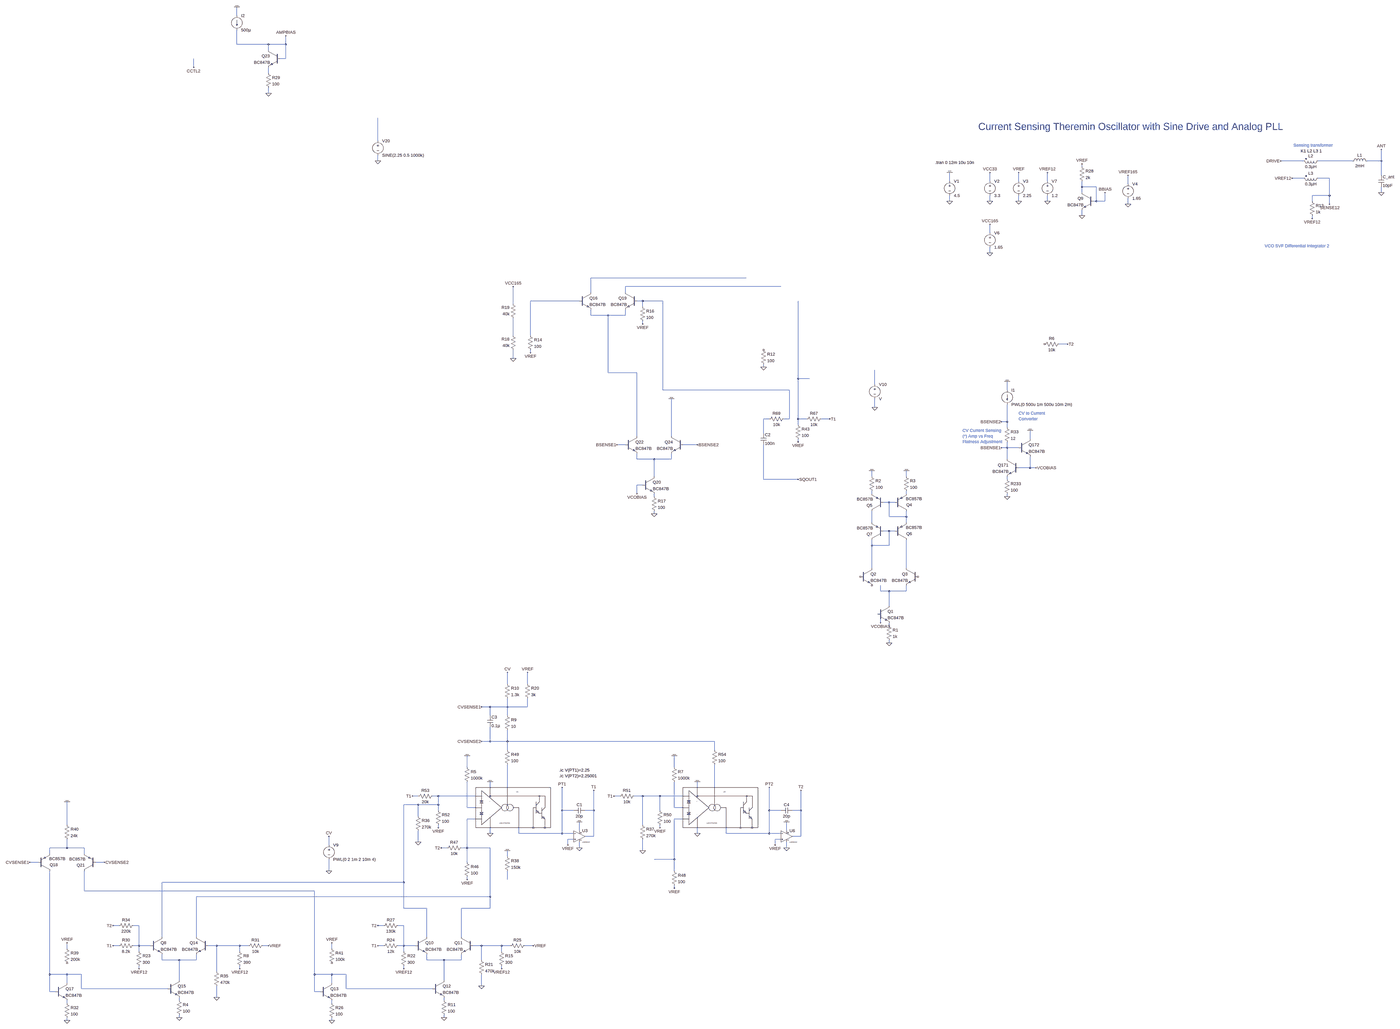
[diagram p0: schematic theremin_oscillator_ota_v01.asc, whole sheet]
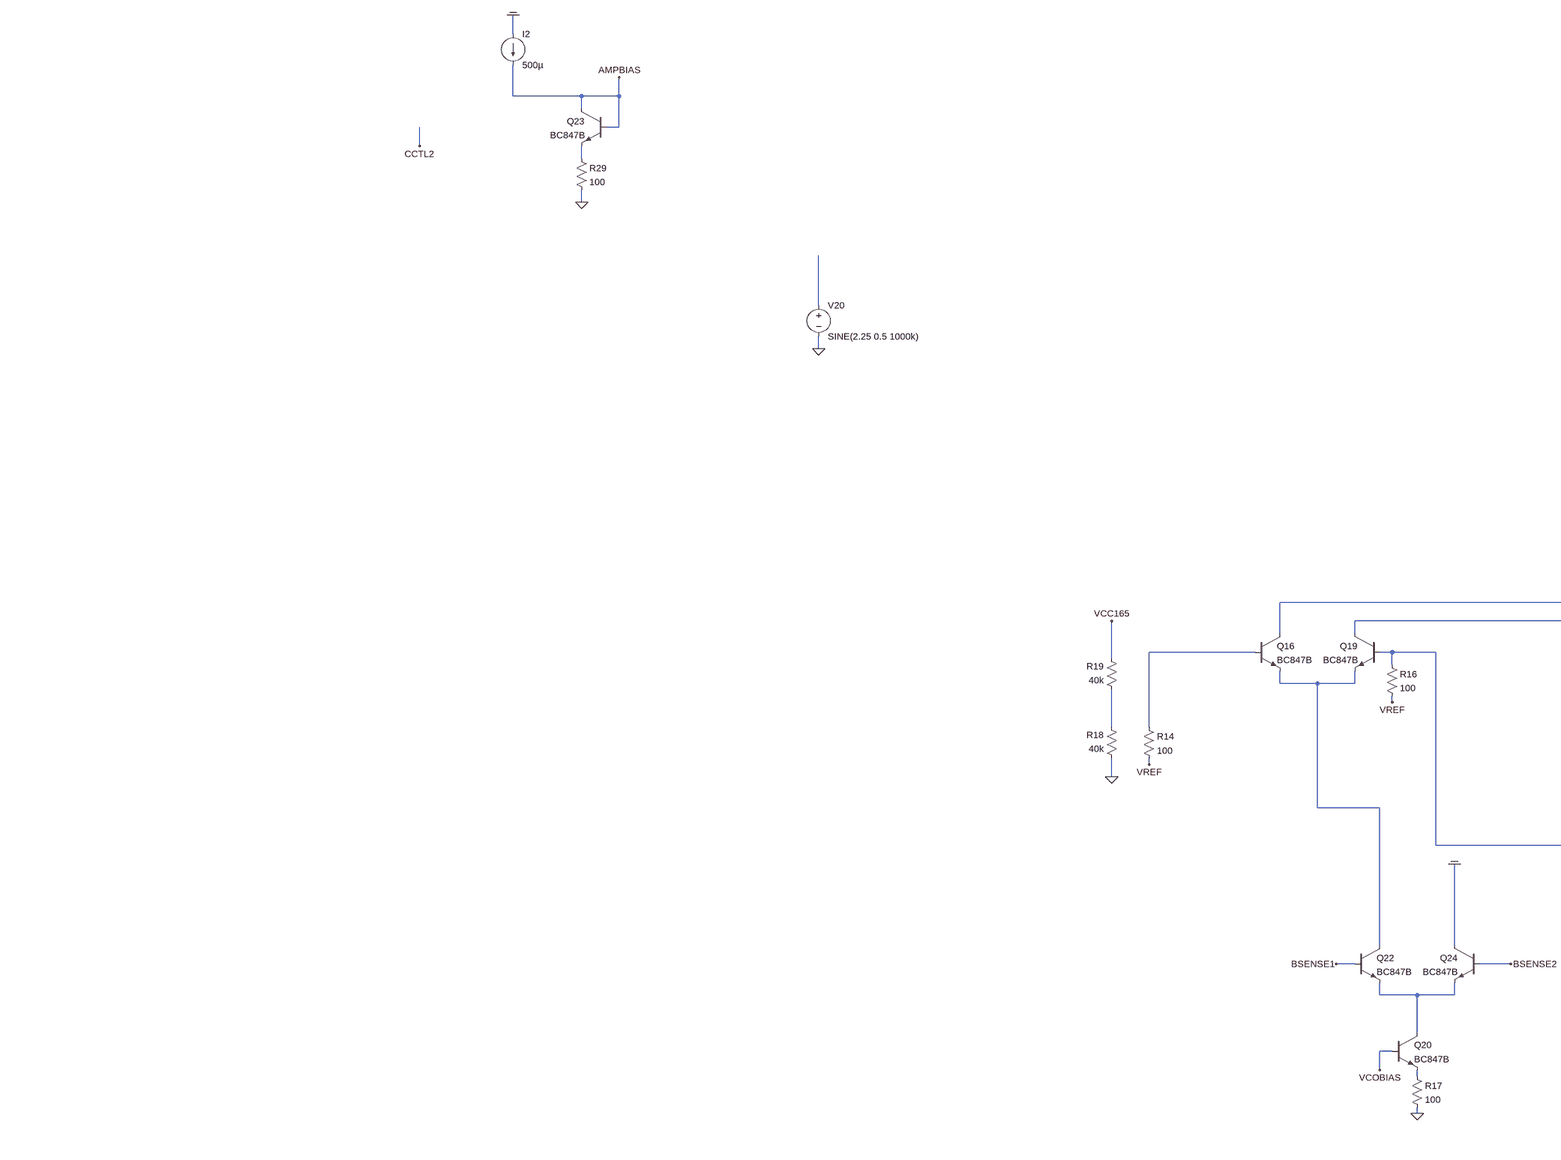
[diagram p1: schematic theremin_oscillator_ota_v01.asc, part, row 1 of 2, column 1 of 2]
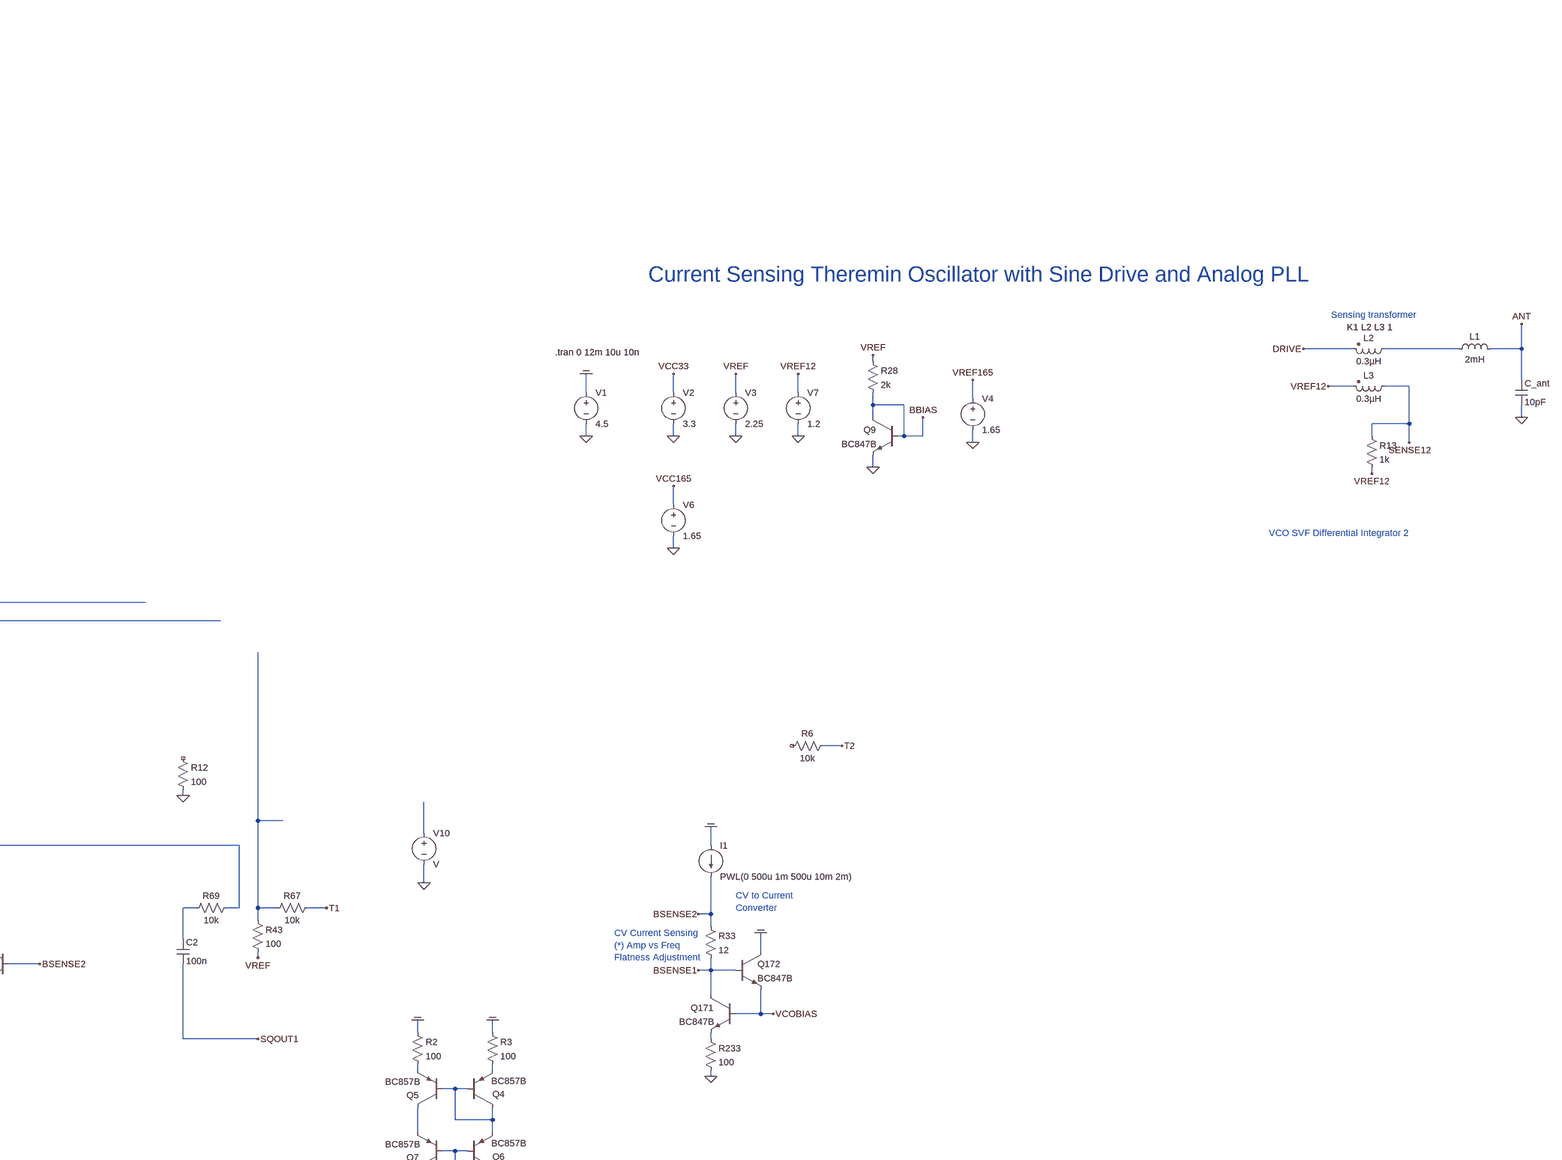
[diagram p2: schematic theremin_oscillator_ota_v01.asc, part, row 1 of 2, column 2 of 2]
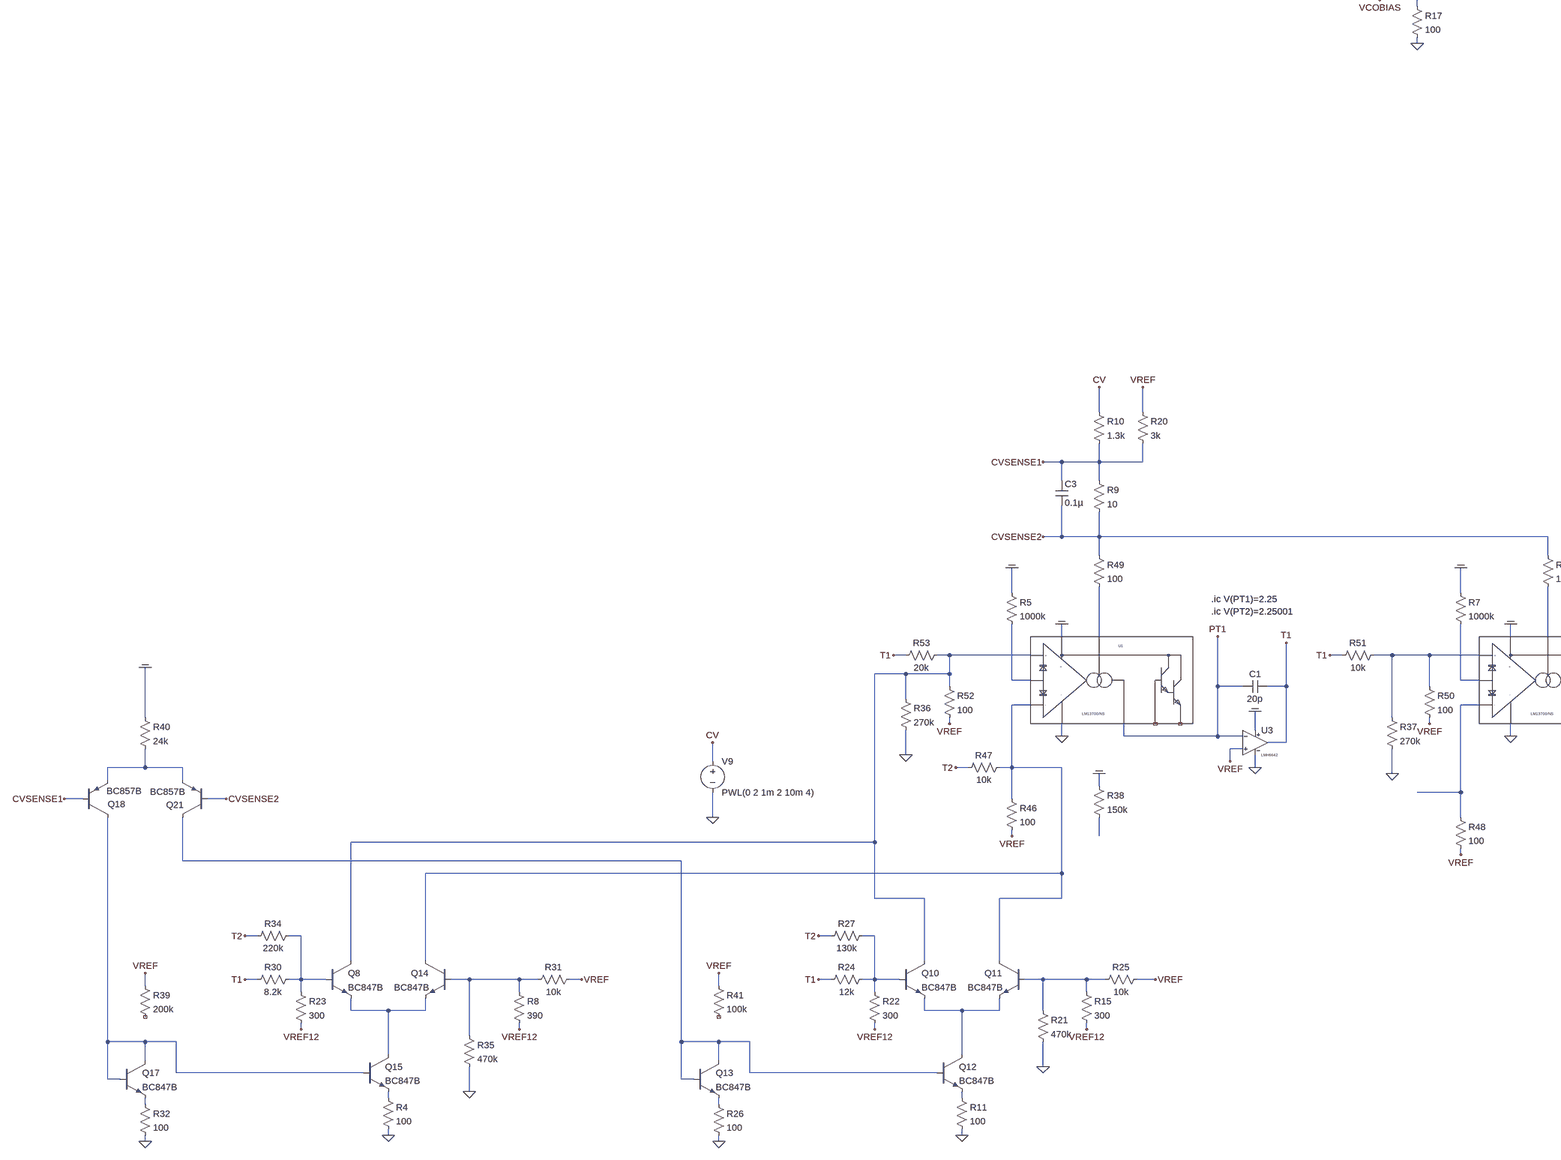
[diagram p3: schematic theremin_oscillator_ota_v01.asc, part, row 2 of 2, column 1 of 2]
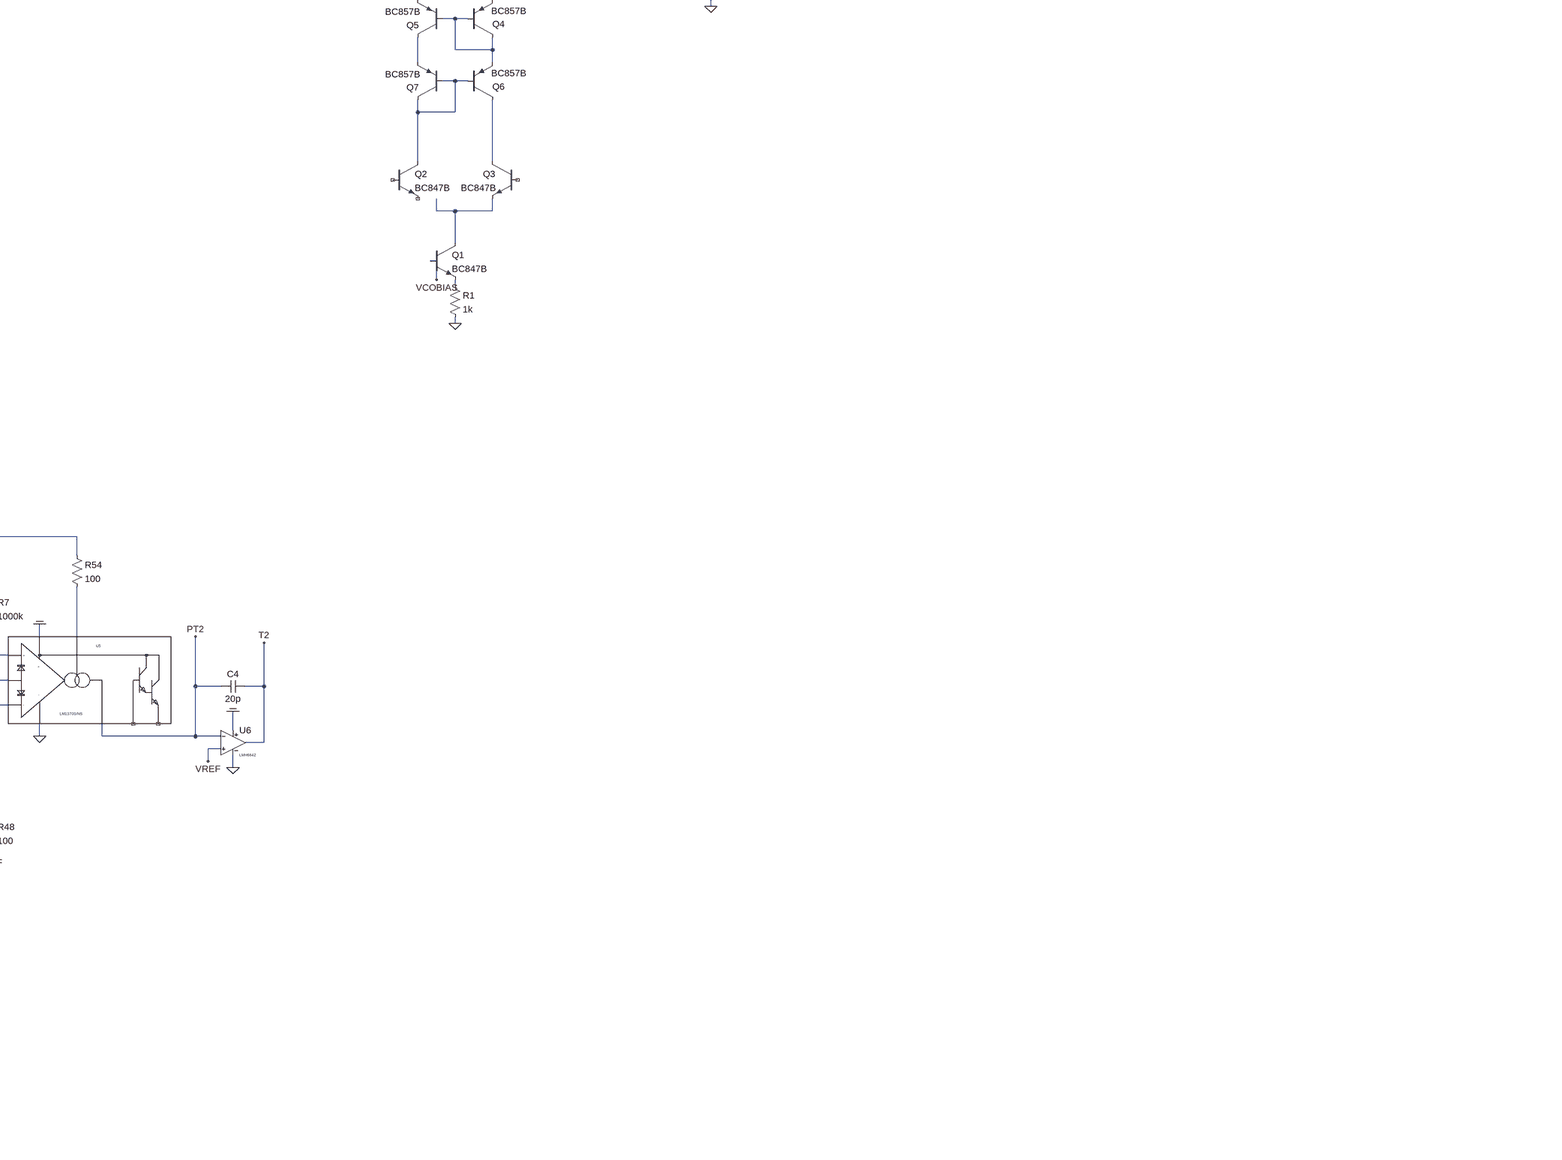
[diagram p4: schematic theremin_oscillator_ota_v01.asc, part, row 2 of 2, column 2 of 2]
theremin_oscillator_ota_v01.asc, the LTspice schematic file:
Version 4
SHEET 1 17540 12720
WIRE -192 2960 -192 2912
WIRE -192 3120 -192 3040
WIRE -16 3120 -192 3120
WIRE 80 3120 80 3072
WIRE 80 3120 -16 3120
WIRE -16 3152 -16 3120
WIRE 80 3200 80 3120
WIRE 80 3200 48 3200
WIRE -432 3248 -432 3200
WIRE -16 3280 -16 3248
WIRE -16 3392 -16 3360
WIRE 592 3664 592 3536
WIRE 592 3776 592 3744
WIRE 5840 3776 5712 3776
WIRE 6112 3776 5920 3776
WIRE 6272 3776 6272 3712
WIRE 6272 3776 6192 3776
WIRE 4608 3808 4608 3792
WIRE 6272 3856 6272 3776
WIRE 5840 3872 5776 3872
WIRE 5984 3872 5920 3872
WIRE 3872 3888 3872 3840
WIRE 4096 3888 4096 3840
WIRE 4256 3888 4256 3840
WIRE 4416 3888 4416 3840
WIRE 4864 3904 4864 3856
WIRE 4608 3920 4608 3888
WIRE 4688 3920 4608 3920
WIRE 4608 3952 4608 3920
WIRE 6272 3952 6272 3920
WIRE 5984 3968 5984 3872
WIRE 5984 3968 5888 3968
WIRE 3872 4000 3872 3968
WIRE 4096 4000 4096 3968
WIRE 4256 4000 4256 3968
WIRE 4416 4000 4416 3968
WIRE 4688 4000 4688 3920
WIRE 4688 4000 4672 4000
WIRE 4736 4000 4736 3952
WIRE 4736 4000 4688 4000
WIRE 5888 4000 5888 3968
WIRE 4864 4016 4864 3984
WIRE 5984 4016 5984 3968
WIRE 4608 4080 4608 4048
WIRE 5888 4096 5888 4080
WIRE 4096 4176 4096 4128
WIRE 4096 4288 4096 4256
WIRE 2640 5152 1776 5152
WIRE 2832 5200 1968 5200
WIRE 1776 5232 1776 5152
WIRE 1968 5232 1968 5200
WIRE 1712 5280 1440 5280
WIRE 2064 5280 2032 5280
WIRE 2176 5280 2064 5280
WIRE 1344 5296 1344 5200
WIRE 2064 5312 2064 5280
WIRE 1776 5360 1776 5328
WIRE 1872 5360 1776 5360
WIRE 1968 5360 1968 5328
WIRE 1968 5360 1872 5360
WIRE 2064 5408 2064 5392
WIRE 1344 5472 1344 5376
WIRE 1440 5472 1440 5280
WIRE 4528 5520 4480 5520
WIRE 1440 5568 1440 5552
WIRE 1344 5600 1344 5552
WIRE 2736 5648 2736 5632
WIRE 1872 5680 1872 5360
WIRE 2032 5680 1872 5680
WIRE 2928 5712 2928 5280
WIRE 2992 5712 2928 5712
WIRE 3456 5744 3456 5664
WIRE 2176 5776 2176 5280
WIRE 2880 5776 2176 5776
WIRE 4192 5776 4192 5728
WIRE 3456 5872 3456 5824
WIRE 2768 5936 2736 5936
WIRE 2880 5936 2880 5776
WIRE 2880 5936 2848 5936
WIRE 2928 5936 2928 5712
WIRE 2976 5936 2928 5936
WIRE 3104 5936 3056 5936
WIRE 4192 5952 4192 5856
WIRE 4192 5952 4160 5952
WIRE 2928 5968 2928 5936
WIRE 4192 5984 4192 5952
WIRE 2736 6016 2736 5936
WIRE 2032 6032 2032 5680
WIRE 2224 6032 2224 5824
WIRE 4320 6048 4320 6000
WIRE 2928 6064 2928 6048
WIRE 1968 6080 1920 6080
WIRE 2368 6080 2288 6080
WIRE 4192 6096 4192 6064
WIRE 4192 6096 4160 6096
WIRE 4256 6096 4192 6096
WIRE 2032 6160 2032 6128
WIRE 2128 6160 2032 6160
WIRE 2224 6160 2224 6128
WIRE 2224 6160 2128 6160
WIRE 4192 6160 4192 6096
WIRE 4320 6208 4320 6144
WIRE 4320 6208 4256 6208
WIRE 4352 6208 4320 6208
WIRE 2128 6256 2128 6160
WIRE 3440 6256 3440 6224
WIRE 3632 6256 3632 6224
WIRE 2736 6272 2736 6080
WIRE 2928 6272 2736 6272
WIRE 4192 6272 4192 6256
WIRE 2064 6304 2032 6304
WIRE 2032 6352 2032 6304
WIRE 3440 6352 3440 6336
WIRE 3632 6352 3632 6336
WIRE 2128 6368 2128 6352
WIRE 4192 6368 4192 6352
WIRE 3536 6400 3504 6400
WIRE 3568 6400 3536 6400
WIRE 2128 6464 2128 6448
WIRE 3536 6480 3536 6400
WIRE 3632 6480 3632 6448
WIRE 3632 6480 3536 6480
WIRE 3440 6512 3440 6448
WIRE 3632 6512 3632 6480
WIRE 3536 6560 3504 6560
WIRE 3568 6560 3536 6560
WIRE 3440 6640 3440 6608
WIRE 3536 6640 3536 6560
WIRE 3536 6640 3440 6640
WIRE 3440 6816 3440 6640
WIRE 3632 6816 3632 6608
WIRE 3488 6944 3488 6912
WIRE 3536 6944 3488 6944
WIRE 3632 6944 3632 6912
WIRE 3632 6944 3536 6944
WIRE 3536 7024 3536 6944
WIRE 3488 7072 3472 7072
WIRE 3488 7120 3488 7072
WIRE 3536 7136 3536 7120
WIRE 3536 7232 3536 7216
WIRE 1312 8464 1312 8400
WIRE 1424 8464 1424 8400
WIRE 1216 8592 1168 8592
WIRE 1312 8592 1312 8544
WIRE 1312 8592 1216 8592
WIRE 1424 8592 1424 8544
WIRE 1424 8592 1312 8592
WIRE 1216 8640 1216 8592
WIRE 1312 8640 1312 8592
WIRE 1216 8784 1216 8704
WIRE 1216 8784 1168 8784
WIRE 1312 8784 1312 8720
WIRE 1312 8784 1216 8784
WIRE 2464 8784 1312 8784
WIRE 1312 8832 1312 8784
WIRE 2464 8832 2464 8784
WIRE 1088 8928 1088 8864
WIRE 2240 8928 2240 8864
WIRE 1216 9040 1216 9008
WIRE 1312 9040 1312 8912
WIRE 2368 9040 2368 9008
WIRE 2464 9040 2464 8912
WIRE 816 9088 784 9088
WIRE 928 9088 896 9088
WIRE 1136 9088 928 9088
WIRE 1936 9088 1904 9088
WIRE 2064 9088 2016 9088
WIRE 2160 9088 2064 9088
WIRE 2288 9088 2160 9088
WIRE 816 9136 736 9136
WIRE 928 9136 928 9088
WIRE 928 9136 816 9136
WIRE 1088 9152 1088 9008
WIRE 1136 9152 1088 9152
WIRE 2240 9152 2240 9008
WIRE 2288 9152 2240 9152
WIRE 928 9168 928 9136
WIRE 1616 9168 1616 9040
WIRE 1680 9168 1616 9168
WIRE 1792 9168 1792 9056
WIRE 1792 9168 1744 9168
WIRE 2160 9168 2160 9088
WIRE 2768 9168 2768 9040
WIRE 2832 9168 2768 9168
WIRE 2944 9168 2944 9056
WIRE 2944 9168 2896 9168
WIRE 816 9200 816 9136
WIRE 1136 9216 1088 9216
WIRE 2288 9216 2240 9216
WIRE -1136 9248 -1136 9120
WIRE 2064 9248 2064 9088
WIRE 928 9264 928 9248
WIRE 2160 9264 2160 9248
WIRE 1712 9280 1712 9232
WIRE 2864 9280 2864 9232
WIRE 1216 9296 1216 9264
WIRE 1376 9296 1376 9264
WIRE 1616 9296 1616 9168
WIRE 1616 9296 1376 9296
WIRE 1680 9296 1616 9296
WIRE 2368 9296 2368 9264
WIRE 2528 9296 2528 9264
WIRE 2768 9296 2768 9168
WIRE 2768 9296 2528 9296
WIRE 2832 9296 2768 9296
WIRE 1792 9312 1792 9168
WIRE 1792 9312 1744 9312
WIRE 2944 9312 2944 9168
WIRE 2944 9312 2896 9312
WIRE 1680 9328 1648 9328
WIRE 2832 9328 2800 9328
WIRE 816 9344 816 9280
WIRE 320 9360 320 9312
WIRE 1648 9360 1648 9328
WIRE 2800 9360 2800 9328
WIRE -1136 9376 -1136 9328
WIRE -1136 9376 -1232 9376
WIRE -1040 9376 -1136 9376
WIRE 976 9376 944 9376
WIRE 1088 9376 1088 9216
WIRE 1088 9376 1056 9376
WIRE 1216 9376 1088 9376
WIRE 1712 9376 1712 9344
WIRE 2864 9376 2864 9344
WIRE 2064 9392 2064 9328
WIRE -1232 9408 -1232 9376
WIRE -1040 9408 -1040 9376
WIRE 1312 9424 1312 9392
WIRE 2240 9440 2240 9216
WIRE 2240 9440 2128 9440
WIRE -1296 9456 -1344 9456
WIRE -928 9456 -976 9456
WIRE 1088 9456 1088 9376
WIRE 320 9504 320 9440
WIRE 2240 9504 2240 9440
WIRE 1088 9552 1088 9536
WIRE 1312 9552 1312 9504
WIRE 736 9568 736 9136
WIRE 736 9568 -608 9568
WIRE 2240 9600 2240 9584
WIRE -1040 9616 -1040 9504
WIRE 240 9616 -1040 9616
WIRE 1216 9648 1216 9376
WIRE 1216 9648 -416 9648
WIRE 736 9712 736 9568
WIRE 864 9712 736 9712
WIRE 1216 9712 1216 9648
WIRE 1216 9712 1056 9712
WIRE -848 9808 -880 9808
WIRE -736 9808 -768 9808
WIRE 624 9808 592 9808
WIRE 736 9808 704 9808
WIRE -608 9872 -608 9568
WIRE -416 9872 -416 9648
WIRE 864 9872 864 9712
WIRE 1056 9872 1056 9712
WIRE -848 9920 -880 9920
WIRE -736 9920 -736 9808
WIRE -736 9920 -768 9920
WIRE -672 9920 -736 9920
WIRE -304 9920 -352 9920
WIRE -176 9920 -304 9920
WIRE -128 9920 -176 9920
WIRE -16 9920 -48 9920
WIRE 624 9920 592 9920
WIRE 736 9920 736 9808
WIRE 736 9920 704 9920
WIRE 800 9920 736 9920
WIRE 1168 9920 1120 9920
WIRE 1280 9920 1168 9920
WIRE 1328 9920 1280 9920
WIRE 1456 9920 1408 9920
WIRE -1136 9936 -1136 9904
WIRE 336 9936 336 9904
WIRE -736 9952 -736 9920
WIRE -176 9952 -176 9920
WIRE 736 9952 736 9920
WIRE 1280 9952 1280 9920
WIRE -608 10000 -608 9968
WIRE -512 10000 -608 10000
WIRE -416 10000 -416 9968
WIRE -416 10000 -512 10000
WIRE 864 10000 864 9968
WIRE 960 10000 864 10000
WIRE 1056 10000 1056 9968
WIRE 1056 10000 960 10000
WIRE 1168 10000 1168 9920
WIRE -736 10048 -736 10032
WIRE -176 10048 -176 10032
WIRE 736 10048 736 10032
WIRE 1280 10048 1280 10032
WIRE -304 10064 -304 9920
WIRE -1232 10080 -1232 9504
WIRE -1136 10080 -1232 10080
WIRE -1056 10080 -1136 10080
WIRE 240 10080 240 9616
WIRE 336 10080 240 10080
WIRE 416 10080 336 10080
WIRE -512 10112 -512 10000
WIRE 960 10112 960 10000
WIRE -1136 10128 -1136 10080
WIRE 336 10128 336 10080
WIRE 1168 10144 1168 10080
WIRE -1056 10160 -1056 10080
WIRE -576 10160 -1056 10160
WIRE 416 10160 416 10080
WIRE 896 10160 416 10160
WIRE -1232 10176 -1232 10080
WIRE -1200 10176 -1232 10176
WIRE 240 10176 240 10080
WIRE 272 10176 240 10176
WIRE -304 10208 -304 10144
WIRE -512 10224 -512 10208
WIRE 960 10224 960 10208
WIRE -1136 10240 -1136 10224
WIRE 336 10240 336 10224
WIRE -512 10320 -512 10304
WIRE 960 10320 960 10304
WIRE -1136 10336 -1136 10320
WIRE 336 10336 336 10320
FLAG 3872 4000 0
FLAG 3872 3840 COM
FLAG 4096 4000 0
FLAG 4096 3840 VCC33
FLAG 4256 4000 0
FLAG 4256 3840 VREF
FLAG 6272 3712 ANT
FLAG 6272 3952 0
FLAG 5712 3776 DRIVE
FLAG 4416 4000 0
FLAG 4416 3840 VREF12
FLAG 5776 3872 VREF12
FLAG 5984 4016 SENSE12
FLAG 5888 4096 VREF12
FLAG -432 3248 CCTL2
FLAG 592 3776 0
FLAG 4192 6368 0
FLAG 4320 6000 COM
FLAG 4352 6208 VCOBIAS
FLAG -16 3392 0
FLAG -192 2912 COM
FLAG 80 3072 AMPBIAS
FLAG 4160 6096 BSENSE1
FLAG 4160 5952 BSENSE2
FLAG 4608 4080 0
FLAG 4736 3952 BBIAS
FLAG 4608 3792 VREF
FLAG 4864 4016 0
FLAG 4864 3856 VREF165
FLAG 2928 6064 VREF
FLAG 3104 5936 T1
FLAG 4192 5728 COM
FLAG 3536 7232 0
FLAG 3488 7120 VCOBIAS
FLAG 3440 6224 COM
FLAG 3632 6224 COM
FLAG 4096 4288 0
FLAG 4096 4128 VCC165
FLAG 4528 5520 T2
FLAG 2928 6272 SQOUT1
FLAG 1440 5568 VREF
FLAG 2064 5408 VREF
FLAG 2128 6464 0
FLAG 2032 6352 VCOBIAS
FLAG 1920 6080 BSENSE1
FLAG 2368 6080 BSENSE2
FLAG 2736 5648 0
FLAG 2224 5824 COM
FLAG 1344 5200 VCC165
FLAG 1344 5600 0
FLAG 3456 5872 0
FLAG 1216 9296 0
FLAG 1216 9008 COM
FLAG 1712 9376 0
FLAG 1712 9232 COM
FLAG 1648 9360 VREF
FLAG 1792 9056 T1
FLAG 1616 9040 PT1
FLAG 2368 9296 0
FLAG 2368 9008 COM
FLAG 2864 9376 0
FLAG 2864 9232 COM
FLAG 2800 9360 VREF
FLAG 2944 9056 T2
FLAG 2768 9040 PT2
FLAG 1088 9552 VREF
FLAG 944 9376 T2
FLAG 2240 9600 VREF
FLAG 2160 9264 VREF
FLAG 1904 9088 T1
FLAG 928 9264 VREF
FLAG 784 9088 T1
FLAG 1088 8864 COM
FLAG 2240 8864 COM
FLAG 960 10320 0
FLAG 1280 10048 VREF12
FLAG 336 10336 0
FLAG 1456 9920 VREF
FLAG 320 9504 0
FLAG 320 9312 CV
FLAG 1312 8400 CV
FLAG 1424 8400 VREF
FLAG 1168 8592 CVSENSE1
FLAG 1168 8784 CVSENSE2
FLAG 1168 10144 0
FLAG -512 10320 0
FLAG -176 10048 VREF12
FLAG -736 10048 VREF12
FLAG -880 9920 T1
FLAG -1136 10336 0
FLAG -16 9920 VREF
FLAG -880 9808 T2
FLAG -304 10208 0
FLAG -1344 9456 CVSENSE1
FLAG -928 9456 CVSENSE2
FLAG 736 10048 VREF12
FLAG 592 9920 T1
FLAG 592 9808 T2
FLAG 816 9344 0
FLAG 2064 9392 0
FLAG 1312 9392 COM
FLAG -1136 9904 VREF
FLAG 336 9904 VREF
FLAG -1136 9120 COM
SYMBOL voltage 3872 3872 R0
SYMATTR InstName V1
SYMATTR Value 4.5
SYMBOL voltage 4096 3872 R0
SYMATTR InstName V2
SYMATTR Value 3.3
SYMBOL voltage 4256 3872 R0
SYMATTR InstName V3
SYMATTR Value 2.25
SYMBOL ind 6096 3792 R270
WINDOW 0 32 56 VTop 2
WINDOW 3 5 56 VBottom 2
SYMATTR InstName L1
SYMATTR Value 2mH
SYMATTR SpiceLine Rser=120 Cpar=1pF
SYMBOL Cap 6256 3856 R0
SYMATTR InstName C_ant
SYMATTR Value 10pF
SYMBOL voltage 4416 3872 R0
SYMATTR InstName V7
SYMATTR Value 1.2
SYMBOL ind2 5936 3760 R90
WINDOW 0 4 56 VBottom 2
WINDOW 3 32 56 VTop 2
SYMATTR InstName L2
SYMATTR Value 0.3µH
SYMATTR SpiceLine Rser=0.1 Cpar=0.1p
SYMBOL ind2 5936 3856 R90
WINDOW 0 4 56 VBottom 2
WINDOW 3 32 56 VTop 2
SYMATTR InstName L3
SYMATTR Value 0.3µH
SYMATTR SpiceLine Rser=0.1 Cpar=0.1p
SYMBOL Res 5872 3984 R0
SYMATTR InstName R13
SYMATTR Value 1k
SYMBOL Voltage 592 3648 R0
SYMATTR InstName V20
SYMATTR Value SINE(2.25 0.5 1000k)
SYMBOL Res 4176 6256 R0
SYMATTR InstName R233
SYMATTR Value 100
SYMBOL npn 4256 6160 M0
SYMATTR InstName Q171
SYMATTR Value BC847B
SYMBOL npn 4256 6048 R0
SYMATTR InstName Q172
SYMATTR Value BC847B
SYMBOL npn 48 3152 M0
SYMATTR InstName Q23
SYMATTR Value BC847B
SYMBOL Res -32 3264 R0
SYMATTR InstName R29
SYMATTR Value 100
SYMBOL current -192 2960 R0
SYMATTR InstName I2
SYMATTR Value 500µ
SYMBOL Res 4176 5968 R0
SYMATTR InstName R33
SYMATTR Value 12
SYMBOL npn 4672 3952 M0
SYMATTR InstName Q9
SYMATTR Value BC847B
SYMBOL Res 4592 3792 R0
SYMATTR InstName R28
SYMATTR Value 2k
SYMBOL voltage 4864 3888 R0
SYMATTR InstName V4
SYMATTR Value 1.65
SYMBOL Res 2912 5952 R0
SYMATTR InstName R43
SYMATTR Value 100
SYMBOL Res 3072 5920 R90
WINDOW 0 0 56 VBottom 2
WINDOW 3 32 56 VTop 2
SYMATTR InstName R67
SYMATTR Value 10k
SYMBOL Res 2864 5920 R90
WINDOW 0 0 56 VBottom 2
WINDOW 3 32 56 VTop 2
SYMATTR InstName R69
SYMATTR Value 10k
SYMBOL current 4192 5776 R0
SYMATTR InstName I1
SYMATTR Value PWL(0 500u 1m 500u 10m 2m)
SYMBOL Res 3520 7120 R0
SYMATTR InstName R1
SYMATTR Value 1k
SYMBOL npn 3472 7024 R0
SYMATTR InstName Q1
SYMATTR Value BC847B
SYMBOL npn 3376 6816 R0
SYMATTR InstName Q2
SYMATTR Value BC847B
SYMBOL npn 3696 6816 M0
SYMATTR InstName Q3
SYMATTR Value BC847B
SYMBOL pnp 3568 6448 M180
WINDOW 0 64 34 Left 2
WINDOW 3 61 68 Left 2
SYMATTR InstName Q4
SYMATTR Value BC857B
SYMBOL pnp 3504 6448 R180
WINDOW 0 60 32 Left 2
WINDOW 3 58 66 Left 2
SYMATTR InstName Q5
SYMATTR Value BC857B
SYMBOL Res 3424 6240 R0
SYMATTR InstName R2
SYMATTR Value 100
SYMBOL Res 3616 6240 R0
SYMATTR InstName R3
SYMATTR Value 100
SYMBOL pnp 3568 6608 M180
WINDOW 0 64 34 Left 2
WINDOW 3 61 68 Left 2
SYMATTR InstName Q6
SYMATTR Value BC857B
SYMBOL pnp 3504 6608 R180
WINDOW 0 60 32 Left 2
WINDOW 3 58 66 Left 2
SYMATTR InstName Q7
SYMATTR Value BC857B
SYMBOL voltage 4096 4160 R0
SYMATTR InstName V6
SYMATTR Value 1.65
SYMBOL Res 4496 5504 R90
WINDOW 0 0 56 VBottom 2
WINDOW 3 32 56 VTop 2
SYMATTR InstName R6
SYMATTR Value 10k
SYMBOL npn 1712 5232 R0
SYMATTR InstName Q16
SYMATTR Value BC847B
SYMBOL npn 2032 5232 M0
SYMATTR InstName Q19
SYMATTR Value BC847B
SYMBOL Res 1424 5456 R0
SYMATTR InstName R14
SYMATTR Value 100
SYMBOL Res 2048 5296 R0
SYMATTR InstName R16
SYMATTR Value 100
SYMBOL Res 2112 6352 R0
SYMATTR InstName R17
SYMATTR Value 100
SYMBOL npn 2064 6256 R0
SYMATTR InstName Q20
SYMATTR Value BC847B
SYMBOL npn 1968 6032 R0
SYMATTR InstName Q22
SYMATTR Value BC847B
SYMBOL npn 2288 6032 M0
SYMATTR InstName Q24
SYMATTR Value BC847B
SYMBOL Res 2720 5536 R0
SYMATTR InstName R12
SYMATTR Value 100
SYMBOL Res 1360 5568 R180
WINDOW 0 36 76 Left 2
WINDOW 3 36 40 Left 2
SYMATTR InstName R18
SYMATTR Value 40k
SYMBOL Res 1360 5392 R180
WINDOW 0 36 76 Left 2
WINDOW 3 36 40 Left 2
SYMATTR InstName R19
SYMATTR Value 40k
SYMBOL Cap 2720 6016 R0
SYMATTR InstName C2
SYMATTR Value 100n
SYMBOL Voltage 3456 5728 R0
SYMATTR InstName V10
SYMBOL LM13700 1216 9152 R0
SYMATTR InstName U1
SYMBOL Cap 1744 9152 R90
WINDOW 0 0 32 VBottom 2
WINDOW 3 32 32 VTop 2
SYMATTR InstName C1
SYMATTR Value 20p
SYMBOL LMH6642 1712 9248 R0
WINDOW 0 16 32 Left 2
SYMATTR InstName U3
SYMBOL LM13700 2368 9152 R0
SYMATTR InstName U5
SYMBOL Cap 2896 9152 R90
WINDOW 0 0 32 VBottom 2
WINDOW 3 32 32 VTop 2
SYMATTR InstName C4
SYMATTR Value 20p
SYMBOL LMH6642 2864 9248 R0
WINDOW 0 16 32 Left 2
SYMATTR InstName U6
SYMBOL Res 1072 9440 R0
SYMATTR InstName R46
SYMATTR Value 100
SYMBOL Res 1072 9360 R90
WINDOW 0 0 56 VBottom 2
WINDOW 3 32 56 VTop 2
SYMATTR InstName R47
SYMATTR Value 10k
SYMBOL Res 2224 9488 R0
SYMATTR InstName R48
SYMATTR Value 100
SYMBOL Res 2144 9152 R0
SYMATTR InstName R50
SYMATTR Value 100
SYMBOL Res 2032 9072 R90
WINDOW 0 0 56 VBottom 2
WINDOW 3 32 56 VTop 2
SYMATTR InstName R51
SYMATTR Value 10k
SYMBOL Res 912 9152 R0
SYMATTR InstName R52
SYMATTR Value 100
SYMBOL Res 912 9072 R90
WINDOW 0 0 56 VBottom 2
WINDOW 3 32 56 VTop 2
SYMATTR InstName R53
SYMATTR Value 20k
SYMBOL Res 1296 8816 R0
SYMATTR InstName R49
SYMATTR Value 100
SYMBOL Res 2448 8816 R0
SYMATTR InstName R54
SYMATTR Value 100
SYMBOL Res 1072 8912 R0
SYMATTR InstName R5
SYMATTR Value 1000k
SYMBOL Res 2224 8912 R0
SYMATTR InstName R7
SYMATTR Value 1000k
SYMBOL npn 800 9872 R0
SYMATTR InstName Q10
SYMATTR Value BC847B
SYMBOL npn 1120 9872 M0
SYMATTR InstName Q11
SYMATTR Value BC847B
SYMBOL Res 944 10208 R0
SYMATTR InstName R11
SYMATTR Value 100
SYMBOL npn 896 10112 R0
SYMATTR InstName Q12
SYMATTR Value BC847B
SYMBOL Res 1264 9936 R0
SYMATTR InstName R15
SYMATTR Value 300
SYMBOL Res 1424 9904 R90
WINDOW 0 0 56 VBottom 2
WINDOW 3 32 56 VTop 2
SYMATTR InstName R25
SYMATTR Value 10k
SYMBOL Res 320 10224 R0
SYMATTR InstName R26
SYMATTR Value 100
SYMBOL npn 272 10128 R0
SYMATTR InstName Q13
SYMATTR Value BC847B
SYMBOL Res 1296 8624 R0
SYMATTR InstName R9
SYMATTR Value 10
SYMBOL Voltage 320 9344 R0
SYMATTR InstName V9
SYMATTR Value PWL(0 2 1m 2 10m 4)
SYMBOL Res 1296 8448 R0
SYMATTR InstName R10
SYMATTR Value 1.3k
SYMBOL Res 1408 8448 R0
SYMATTR InstName R20
SYMATTR Value 3k
SYMBOL Res 1152 9984 R0
SYMATTR InstName R21
SYMATTR Value 470k
SYMBOL npn -672 9872 R0
SYMATTR InstName Q8
SYMATTR Value BC847B
SYMBOL npn -352 9872 M0
SYMATTR InstName Q14
SYMATTR Value BC847B
SYMBOL Res -528 10208 R0
SYMATTR InstName R4
SYMATTR Value 100
SYMBOL npn -576 10112 R0
SYMATTR InstName Q15
SYMATTR Value BC847B
SYMBOL Res -192 9936 R0
SYMATTR InstName R8
SYMATTR Value 390
SYMBOL Res -752 9936 R0
SYMATTR InstName R23
SYMATTR Value 300
SYMBOL Res -752 9904 R90
WINDOW 0 0 56 VBottom 2
WINDOW 3 32 56 VTop 2
SYMATTR InstName R30
SYMATTR Value 8.2k
SYMBOL Res -32 9904 R90
WINDOW 0 0 56 VBottom 2
WINDOW 3 32 56 VTop 2
SYMATTR InstName R31
SYMATTR Value 10k
SYMBOL Res -1152 10224 R0
SYMATTR InstName R32
SYMATTR Value 100
SYMBOL npn -1200 10128 R0
SYMATTR InstName Q17
SYMATTR Value BC847B
SYMBOL Res -752 9792 R90
WINDOW 0 0 56 VBottom 2
WINDOW 3 32 56 VTop 2
SYMATTR InstName R34
SYMATTR Value 220k
SYMBOL Res -320 10048 R0
SYMATTR InstName R35
SYMATTR Value 470k
SYMBOL pnp -1296 9504 M180
WINDOW 0 64 34 Left 2
WINDOW 3 61 68 Left 2
SYMATTR InstName Q18
SYMATTR Value BC857B
SYMBOL pnp -976 9504 R180
WINDOW 0 60 32 Left 2
WINDOW 3 58 66 Left 2
SYMATTR InstName Q21
SYMATTR Value BC857B
SYMBOL Res 720 9936 R0
SYMATTR InstName R22
SYMATTR Value 300
SYMBOL Res 720 9904 R90
WINDOW 0 0 56 VBottom 2
WINDOW 3 32 56 VTop 2
SYMATTR InstName R24
SYMATTR Value 12k
SYMBOL Res 720 9792 R90
WINDOW 0 0 56 VBottom 2
WINDOW 3 32 56 VTop 2
SYMATTR InstName R27
SYMATTR Value 130k
SYMBOL Res 800 9184 R0
SYMATTR InstName R36
SYMATTR Value 270k
SYMBOL Res 2048 9232 R0
SYMATTR InstName R37
SYMATTR Value 270k
SYMBOL Res 1296 9408 R0
SYMATTR InstName R38
SYMATTR Value 150k
SYMBOL Res -1152 9920 R0
SYMATTR InstName R39
SYMATTR Value 200k
SYMBOL Res -1152 9232 R0
SYMATTR InstName R40
SYMATTR Value 24k
SYMBOL Res 320 9920 R0
SYMATTR InstName R41
SYMATTR Value 100k
SYMBOL Cap 1200 8640 R0
SYMATTR InstName C3
SYMATTR Value 0.1µ
TEXT 3792 3784 Left 2 !.tran 0 12m 10u 10n
TEXT 4032 3584 Left 5 ;Current Sensing Theremin Oscillator with Sine Drive and Analog PLL
TEXT 5824 3720 Left 2 !K1 L2 L3 1
TEXT 5784 3688 Left 2 ;Sensing transformer
TEXT 5624 4248 Left 2 ;VCO SVF Differential Integrator 2
TEXT 4256 5904 Left 2 ;CV to Current\nConverter
TEXT 3944 6000 Left 2 ;CV Current Sensing\n(*) Amp vs Freq \nFlatness Adjustment
TEXT 1600 8944 Left 2 !.ic V(PT1)=2.25\n.ic V(PT2)=2.25001

The netlist it stands for:
* theremin_oscillator_ota_v01.asc
V1 COM 0 4.5
V2 VCC33 0 3.3
V3 VREF 0 2.25
L1 N003 ANT 2mH Rser=120 Cpar=1pF
C_ant ANT 0 10pF
V7 VREF12 0 1.2
L2 N003 DRIVE 0.3µH Rser=0.1 Cpar=0.1p
L3 SENSE12 VREF12 0.3µH Rser=0.1 Cpar=0.1p
R13 SENSE12 VREF12 1k
V20 N002 0 SINE(2.25 0.5 1000k)
R233 N014 0 100
Q171 BSENSE1 VCOBIAS N014 0 BC847B
Q172 COM BSENSE1 VCOBIAS 0 BC847B
Q23 AMPBIAS AMPBIAS N001 0 BC847B
R29 N001 0 100
I2 COM AMPBIAS 500µ
R33 BSENSE2 BSENSE1 12
Q9 BBIAS BBIAS 0 0 BC847B
R28 VREF BBIAS 2k
V4 VREF165 0 1.65
R43 N010 VREF 100
R67 T1 N010 10k
R69 N007 N012 10k
I1 COM BSENSE2 PWL(0 500u 1m 500u 10m 2m)
R1 N023 0 1k
Q1 N022 VCOBIAS N023 0 BC847B
Q2 N020 NC_01 NC_02 0 BC847B
Q3 N021 NC_03 N022 0 BC847B
Q4 N018 N018 N016 0 BC857B
Q5 N019 N018 N015 0 BC857B
R2 COM N015 100
R3 COM N016 100
Q6 N021 N020 N018 0 BC857B
Q7 N020 N020 N019 0 BC857B
V6 VCC165 0 1.65
R6 T2 NC_04 10k
Q16 N004 N006 N008 0 BC847B
Q19 N005 N007 N008 0 BC847B
R14 N006 VREF 100
R16 N007 VREF 100
R17 N017 0 100
Q20 N013 VCOBIAS N017 0 BC847B
Q22 N008 BSENSE1 N013 0 BC847B
Q24 COM BSENSE2 N013 0 BC847B
R12 NC_05 0 100
R18 0 N009 40k
R19 N009 VCC165 40k
C2 N012 SQOUT1 100n
V10 N011 0 V
XU1 N024 N028 N026 N030 PT1 0 NC_06 NC_07 COM LM13700/NS  ; pins Ibias Dio_bias in+ in- out V- buf_in buf_out V+
C1 T1 PT1 20p
XU3 PT1 VREF COM 0 T1 LMH6642  ; pins In- In+ V+ V- OUT
XU5 N025 N029 N027 N031 PT2 0 NC_08 NC_09 COM LM13700/NS  ; pins Ibias Dio_bias in+ in- out V- buf_in buf_out V+
C4 T2 PT2 20p
XU6 PT2 VREF COM 0 T2 LMH6642  ; pins In- In+ V+ V- OUT
R46 N030 VREF 100
R47 N030 T2 10k
R48 N031 VREF 100
R50 N027 VREF 100
R51 N027 T1 10k
R52 N026 VREF 100
R53 N026 T1 20k
R49 CVSENSE2 N024 100
R54 CVSENSE2 N025 100
R5 COM N028 1000k
R7 COM N029 1000k
Q10 N026 N036 N040 0 BC847B
Q11 N030 N038 N040 0 BC847B
R11 N043 0 100
Q12 N040 N034 N043 0 BC847B
R15 N038 VREF12 300
R25 VREF N038 10k
R26 N045 0 100
Q13 N034 N034 N045 0 BC847B
R9 CVSENSE1 CVSENSE2 10
V9 CV 0 PWL(0 2 1m 2 10m 4)
R10 CV CVSENSE1 1.3k
R20 VREF CVSENSE1 3k
R21 N038 0 470k
Q8 N026 N035 N039 0 BC847B
Q14 N030 N037 N039 0 BC847B
R4 N042 0 100
Q15 N039 N041 N042 0 BC847B
R8 N037 VREF12 390
R23 N035 VREF12 300
R30 N035 T1 8.2k
R31 VREF N037 10k
R32 N044 0 100
Q17 N041 N041 N044 0 BC847B
R34 N035 T2 220k
R35 N037 0 470k
Q18 N041 CVSENSE1 N032 0 BC857B
Q21 N034 CVSENSE2 N032 0 BC857B
R22 N036 VREF12 300
R24 N036 T1 12k
R27 N036 T2 130k
R36 N026 0 270k
R37 N027 0 270k
R38 COM N033 150k
R39 VREF NC_10 200k
R40 COM N032 24k
R41 VREF NC_11 100k
C3 CVSENSE1 CVSENSE2 0.1µ
.model NPN NPN
.model PNP PNP
.lib standard.bjt
.tran 0 12m 10u 10n
* Current Sensing Theremin Oscillator with Sine Drive and Analog PLL
K1 L2 L3 1
* Sensing transformer
* VCO SVF Differential Integrator 2
* CV to Current
* Converter
* CV Current Sensing
* (*) Amp vs Freq
* Flatness Adjustment
.ic V(PT1)=2.25
.ic V(PT2)=2.25001
.lib ns_models.lib
.lib LMH6642.MOD
.backanno
.end